# Altium schematic sheet MCU.SchDoc
size A4
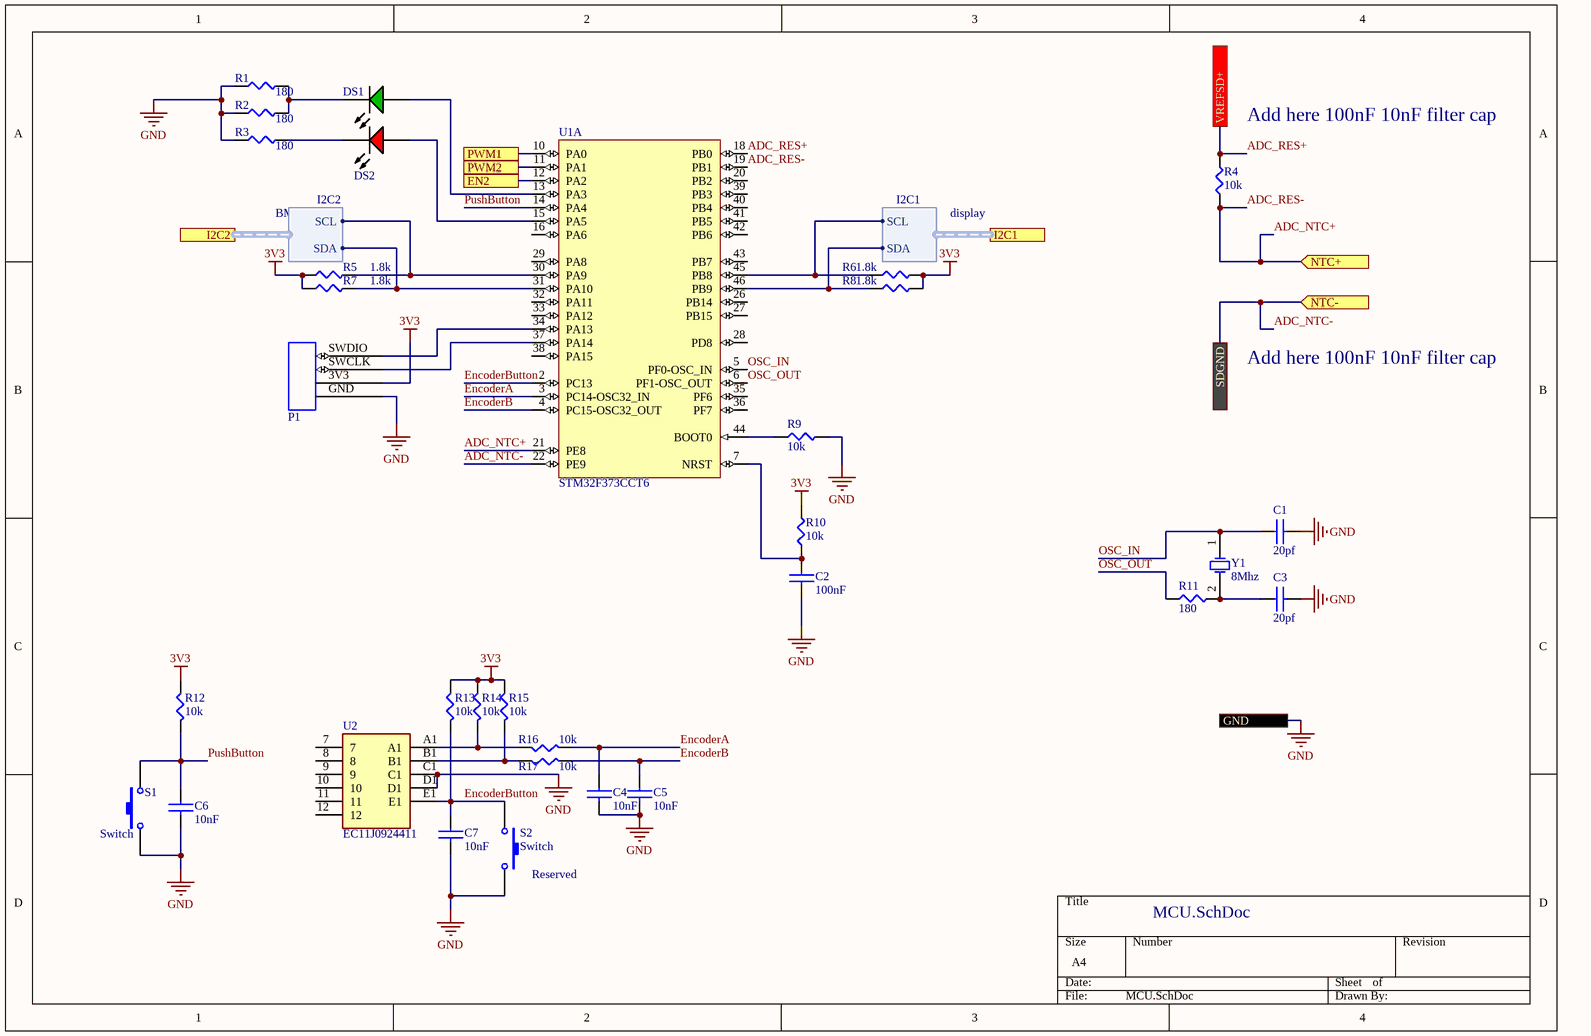
[diagram p0: MCU.SchDoc]

## Parts
C1  20pf  [CAPC160X80X90L35N]
C2  100nF  [CAPC160X80X90L35N]
C3  20pf  [CAPC160X80X90L35N]
C4  10nF  [CAPC160X80X90L35N]
C5  10nF  [CAPC160X80X90L35N]
C6  10nF  [CAPC160X80X90L35N]
C7  10nF  [CAPC160X80X90L35N]
DS1  19-217/GHC-YR1S2/3T  [LEDC160X80X60L30N]  (value not drawn)
DS2  FC-2012HRK-620D  [LEDC200X125X110L30N]  (value not drawn)
P1  SWD  [SWD]  (value not drawn)
R1  180  [RESC160X80X90L30N]
R2  180  [RESC160X80X90L30N]
R3  180  [RESC160X80X90L30N]
R4  10k  [RESC160X80X90L30N]
R5  1.8k  [RESC160X80X90L30N]
R6  1.8k  [RESC160X80X90L30N]
R7  1.8k  [RESC160X80X90L30N]
R8  1.8k  [RESC160X80X90L30N]
R9  10k  [RESC160X80X90L30N]
R10  10k  [RESC160X80X90L30N]
R11  180  [RESC160X80X90L30N]
R12  10k  [RESC160X80X90L30N]
R13  10k  [RESC160X80X90L30N]
R14  10k  [RESC160X80X90L30N]
R15  10k  [RESC160X80X90L30N]
R16  10k  [RESC160X80X90L30N]
R17  10k  [RESC160X80X90L30N]
S1  Switch  [Tactile switch]
S2  Switch  [Tactile switch]
U1  STM32F373CCT6  [STM-LQFP48_L]  (part A of 2)
U2  EC11J0924411  [EC11J0924411]
Y1  8Mhz  [5032]

## Ports
EN2, GND, I2C1 (harness I2C1), I2C2 (harness I2C2), NTC+ (in), NTC- (in), PWM1, PWM2, SDGND, VREFSD+

## Harnesses
I2C1: SCL, SDA
I2C2: SCL, SDA

## Nets
3V3: P1.3V3 R5.1 R6.2 R7.1 R8.2 R10.2 R12.1 R13.1 R14.1 R15.1
GND: C1.2 C2.2 C3.2 C4.2 C5.2 C6.2 C7.2 P1.GND R1.1 R2.1 R3.1 R9.2 S1.1 S2.2 U2.C1 U2.D1 ; port GND
ADC_NTC+: R4.1 U1.19(PB1) U1.21(PE8) ; port NTC+  [also labelled ADC_RES-]
ADC_NTC-: U1.22(PE9) ; port NTC-, port SDGND
ADC_RES+: R4.2 U1.18(PB0) ; port VREFSD+
EN2: U1.12(PA2) ; port EN2
EncoderA: C4.1 R16.2 U1.3(PC14-OSC32_IN)
EncoderB: C5.1 R17.2 U1.4(PC15-OSC32_OUT)
EncoderButton: C7.1 R13.2 S2.1 U1.2(PC13) U2.E1
OSC_IN: C1.1 U1.5(PF0-OSC_IN) Y1.1(OSC1)
OSC_OUT: R11.1 U1.6(PF1-OSC_OUT)
PushButton: C6.1 R12.2 S1.2 U1.14(PA4)
PWM1: U1.10(PA0) ; port PWM1
PWM2: U1.11(PA1) ; port PWM2
NetC2_1: C2.1 R10.1 U1.7(NRST)
NetC3_1: C3.1 R11.2 Y1.2(OSC2)
NetDS1_A: DS1.A U1.13(PA3)
NetDS1_C: DS1.C R1.2 R2.2
NetDS2_A: DS2.A U1.15(PA5)
NetDS2_C: DS2.C R3.2
NetP1_SWCLK: P1.SWCLK U1.37(PA14)
NetP1_SWDIO: P1.SWDIO U1.34(PA13)
NetR5_2: R5.2 U1.30(PA9) ; port I2C2.SCL
NetR6_1: R6.1 U1.45(PB8) ; port I2C1.SCL
NetR7_2: R7.2 U1.31(PA10) ; port I2C2.SDA
NetR8_1: R8.1 U1.46(PB9) ; port I2C1.SDA
NetR9_1: R9.1 U1.44(BOOT0)
NetR14_2: R14.2 R16.1 U2.A1
NetR15_2: R15.2 R17.1 U2.B1

Not connected (* = marked no-connect by the designer): U1 16(PA6) 20(PB2) 26(PB14) 27(PB15) 28(PD8) 29(PA8) 32(PA11) 33(PA12) 35(PF6) 36(PF7) 38(PA15) 39(PB3) 40(PB4) 41(PB5) 42(PB6) 43(PB7); U2 7 8 9 10 11 12

## Notes on the sheet
- (near R4) Add here 100nF 10nF filter cap
- BMP280
- display
- Add here 100nF 10nF filter cap
- (near S2) Reserved

## Library data of the parts
C1 C3 = capacitor: Part Number: CL10C200JB8NNNC; Value: 20pf; LCSC Part #: C1648
C2 = capacitor: Part Number: CC0603KRX7R9BB104; Value: 100nF; LCSC Part #: C14663
C4-C7 = capacitor: Part Number: 0603B103K500NT; Value: 10nF; LCSC Part #: C57112
DS1 = LED: Green LED; Part Number: 19-217/GHC-YR1S2/3T; LCSC Part #: C72043
DS2 = RED LED: Part Number: FC-2012HRK-620D; LCSC Part #: C84256; Package: 0805
P1 = SWD port
R1-R3 R11 = Resistor: Part Number: 0603WAF1800T5E; Value: 180; LCSC Part #: C22828
R4 R9 R10 R12-R17 = Resistor: Part Number: 0603WAF1002T5E; Value: 10k; LCSC Part #: C25804
R5-R8 = Resistor: Part Number: 0603WAF1801T5E; Value: 1.8k; LCSC Part #: C4177
S1 S2 = Switch: Part Number: TS-1187A-C-E-B; C57112: C318887; Published: 24-Mar-1999; LatestRevisionDate: 17-Jul-2002; LatestRevisionNote: Re-released for DXP Platform.; PackageReference: SPST-2; Publisher: Altium Limited; PackageDescription: Switch; 2 Leads
U1 = STM32F373CCT6: ARM Cortex-M4 32-bit MCU, 256 KB Flash, 32 KB Internal RAM, 36 I/Os, 48-pin LQFP, -40 to 85 degC, Tray; Manufacturer: STMicroelectronics; FLASH Size (Prog) (kB): 256; Internal RAM Size (kB): 32; Operating Frequency(F) (Processor speed) (MHz): 72; I/Os (High Current): 36; Supply Voltage(Vcc) min (V): 2; Mounting Technology: Surface Mount; ComponentLink2Description: Datasheet; PackageReference: LQFP48; Packing: Tray; PackageVersion: Rev. 6, 06/2013; ComponentLink1Description: Manufacturer URL; ComponentLink3Description: Package Specification; ComponentLink2URL: http://www.st.com/st-web-ui/static/active/en/resource/technical/document/datasheet/DM00046749.pdf; PartNumber: STM32F373CCT6; Core: ARM Cortex-M4; ComponentLink1URL: http://www.st.com/web/en/home.html; ComponentLink3URL: http://www.st.com/st-web-ui/static/active/en/resource/technical/document/datasheet/DM00058181.pdf; DatasheetVersion: Rev. 3; PackageDescription: 48-Pin Low Profile Quad Flat Package, 7 x 7 mm Body, 0.5 mm Pitch; LCSC Part #: C89403; Manufacturer Part Number: STM32F373CCT6
U2 = EC11J0924411: Rotary encoder; Manufacturer_Name: ALPS; Datasheet Link: https://componentsearchengine.com//EC11J0924411.pdf; Height: 24.5mm; Mouser2 Part Number: 688-EC11J0924411; Mouser2 Price/Stock: https://www.mouser.com/Search/Refine.aspx?Keyword=688-EC11J0924411; Manufacturer_Part_Number: EC11J0924411
Y1 = XTAL: Crystal Oscillator; Part Number: X50328MSB2GI; Published: 8-Jun-2000; LatestRevisionDate: 17-Jul-2002; LatestRevisionNote: Re-released for DXP Platform.; PackageReference: R38; Publisher: Altium Limited; PackageDescription: Crystal, Thru-Hole; 2 Leads; Body 3.1 x 8.2 mm (Dia.xH); Value: 8Mhz; LCSC Part #: C115962